# EAGLE design final (EAGLE 7.4.0)
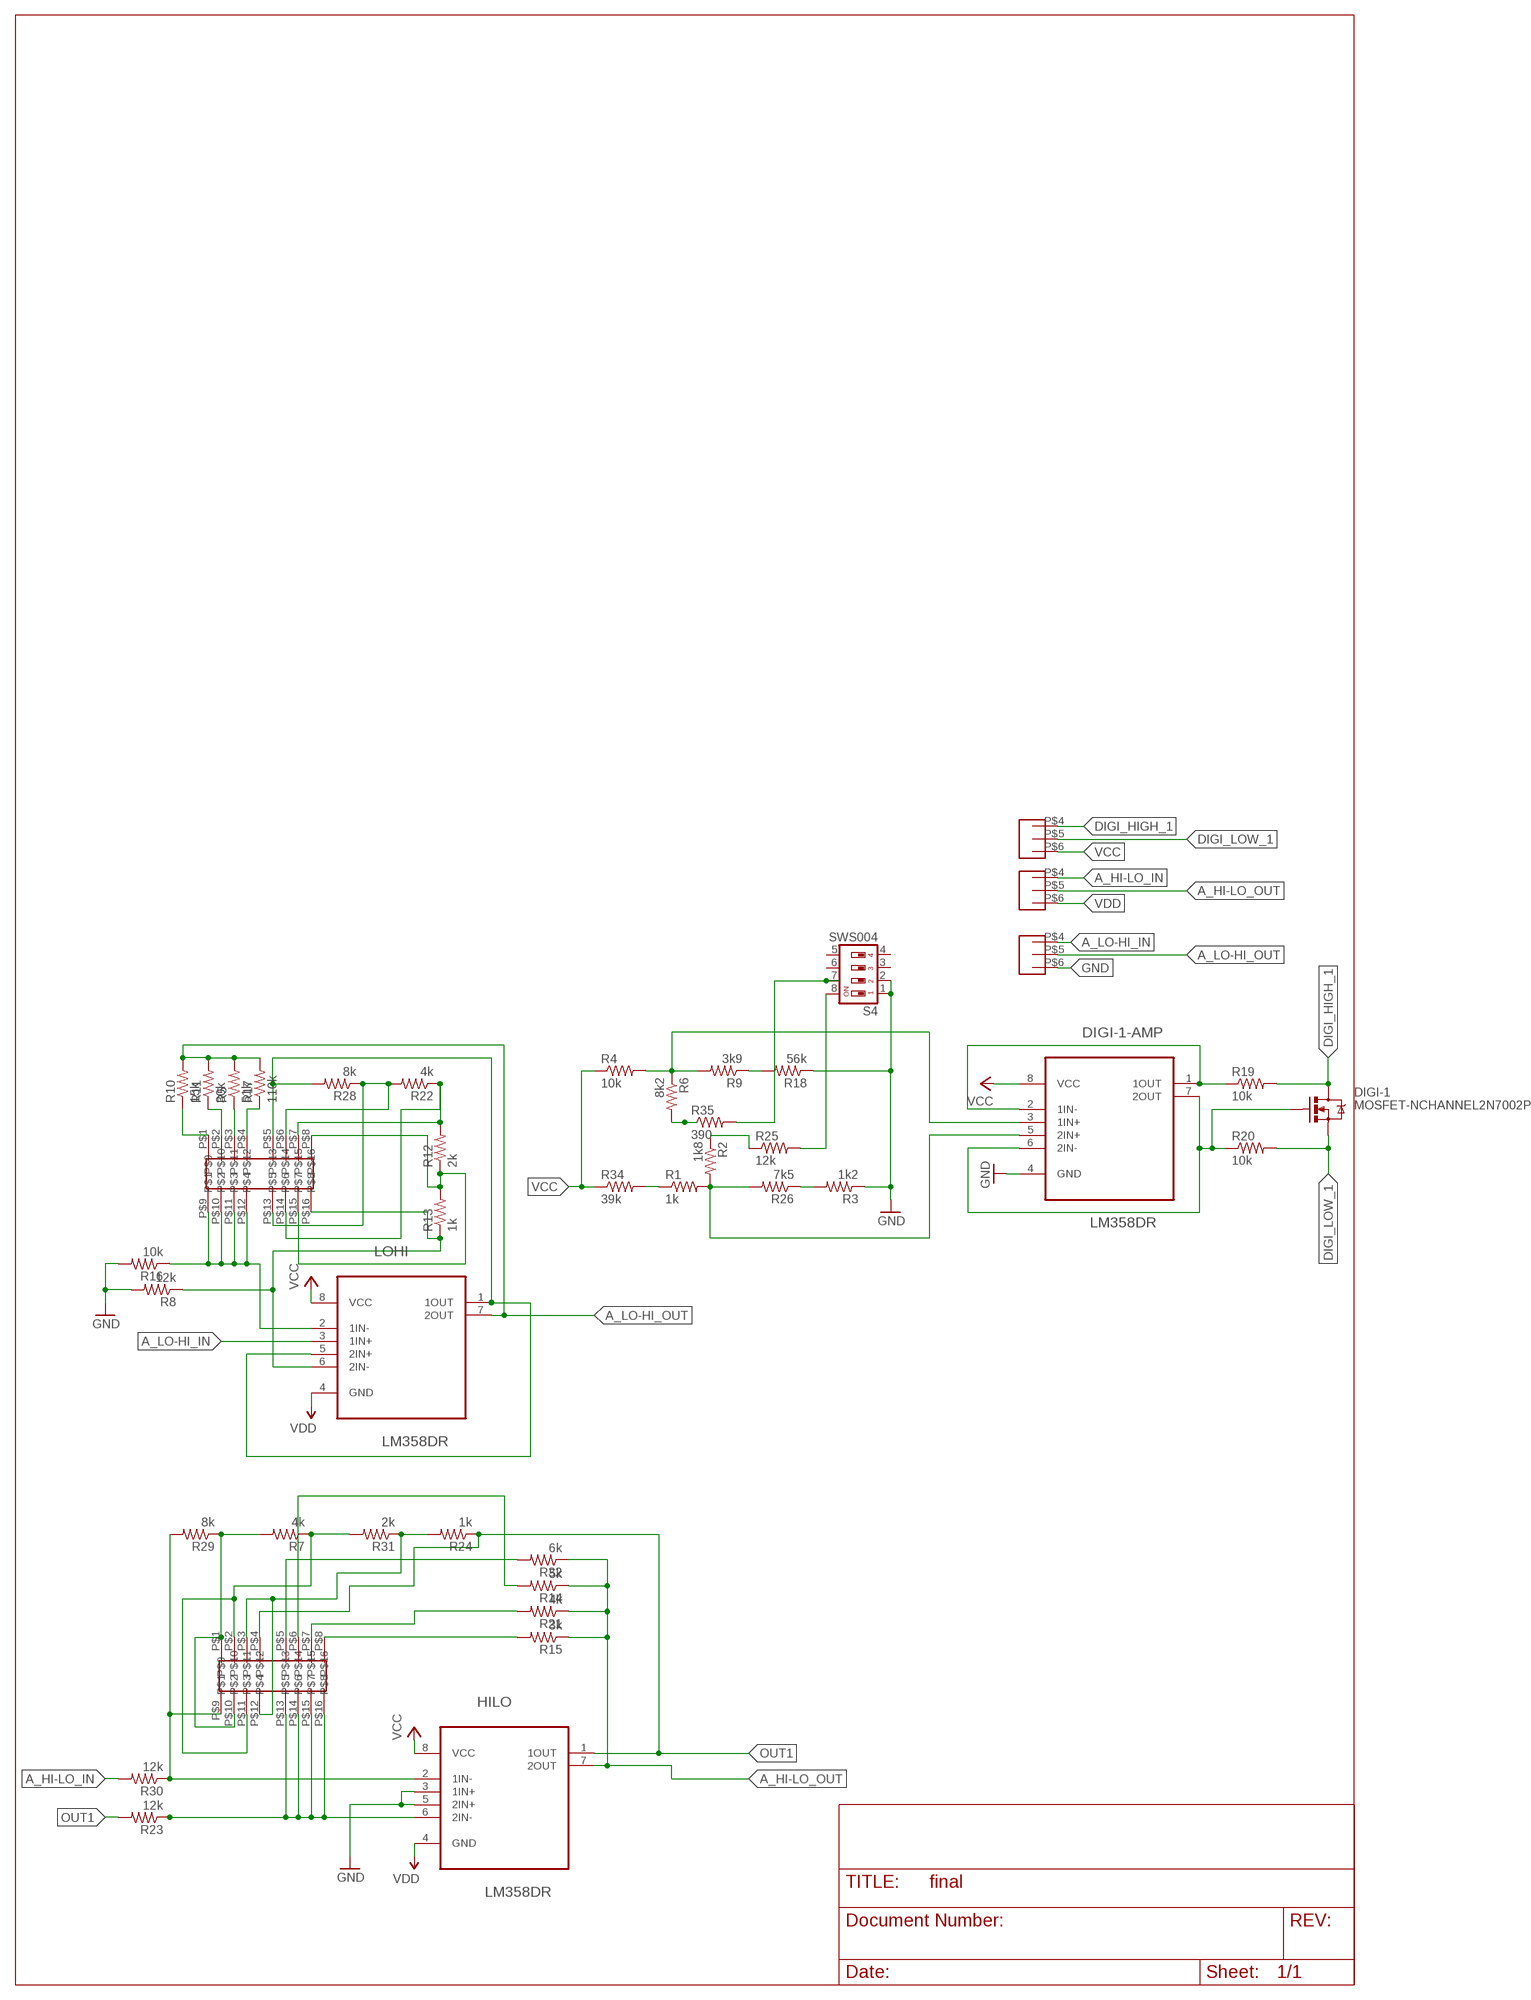
[diagram p0: schematic, sheet 1]

## Parts
DIGI-1  MOSFET-NCHANNEL2N7002PW  [SOT323]
DIGI-1-AMP  LM358DR  [SOIC127P600X175-8N]
HILO  LM358DR  [SOIC127P600X175-8N]
LOHI  LM358DR  [SOIC127P600X175-8N]
R1  1k  R-US_R0805  [R0805]
R2  1k8  R-US_R0805  [R0805]
R3  1k2  R-US_R0805  [R0805]
R4  10k  R-US_R0805  [R0805]
R5  51k  R-US_R0805  [R0805]
R6  8k2  R-US_R0805  [R0805]
R7  4k  R-US_0207/15  [0207/15]
R8  12k  R-US_R0805  [R0805]
R9  3k9  R-US_R0805  [R0805]
R10  15k  R-US_R0805  [R0805]
R11  30k  R-US_R0805  [R0805]
R12  2k  R-US_0207/15  [0207/15]
R13  1k  R-US_R0805  [R0805]
R14  5k  R-US_R0805  [R0805]
R15  3k  R-US_R0805  [R0805]
R16  10k  R-US_R0805  [R0805]
R17  110k  R-US_R0805  [R0805]
R18  56k  R-US_R0805  [R0805]
R19  10k  R-US_R0805  [R0805]
R20  10k  R-US_R0805  [R0805]
R21  4k  R-US_R0805  [R0805]
R22  4k  R-US_0207/15  [0207/15]
R23  12k  R-US_R0805  [R0805]
R24  1k  R-US_0207/15  [0207/15]
R25  12k  R-US_R0805  [R0805]
R26  7k5  R-US_R0805  [R0805]
R28  8k  R-US_0207/15  [0207/15]
R29  8k  R-US_R0805  [R0805]
R30  12k  R-US_R0805  [R0805]
R31  2k  R-US_0207/15  [0207/15]
R32  6k  R-US_R0805  [R0805]
R34  39k  R-US_R0805  [R0805]
R35  390  R-US_R0805  [R0805]
S4  SWS004  [SMS-004]
U$2  USCO_8PIN_SWITCH  [USCO_8PIN_SWITCH]
U$3  USCO_8PIN_SWITCH  [USCO_8PIN_SWITCH]
U$4  5.08PITCHTERMINAL  [10KPL508]
U$5  5.08PITCHTERMINAL  [10KPL508]
U$6  5.08PITCHTERMINAL  [10KPL508]

## Nets
A_HI-LO_IN: R30.2 U$4.P$4
A_HI-LO_OUT: HILO.7(2OUT) R14.1 R15.1 R21.1 R32.1 U$4.P$5
A_LO-HI_IN: LOHI.3(1IN+) U$6.P$4
A_LO-HI_OUT: LOHI.7(2OUT) R5.2 R10.2 R11.2 R17.2 U$6.P$5
DI-1: DIGI-1-AMP.1(1OUT) DIGI-1-AMP.2(1IN-) R19.1
DIGI_HIGH_1: DIGI-1.3(D) R19.2 U$5.P$4
DIGI_LOW_1: DIGI-1.2(S) R20.2 U$5.P$5
GND: DIGI-1-AMP.4(GND) HILO.3(1IN+) HILO.5(2IN+) R3.1 R8.2 R16.2 R18.1 S4.1 S4.2 U$6.P$6
N$2: DIGI-1-AMP.3(1IN+) R4.2 R6.1 R9.2
N$4: R25.2 S4.8
N$5: R6.2 R35.1
N$6: DIGI-1-AMP.5(2IN+) R1.2 R2.2 R26.2
N$8: DIGI-1-AMP.6(2IN-) DIGI-1-AMP.7(2OUT) DIGI-1.1(G) R20.1
N$9: R9.1 R18.2
N$10: HILO.2(1IN-) R29.2 R30.1 U$2.P$9
N$11: R2.1 R25.1
N$13: R10.1 U$3.P$1
N$14: R11.1 U$3.P$2
N$15: R1.1 R34.2
N$16: R5.1 U$3.P$3
N$17: R17.1 U$3.P$4
N$18: LOHI.1(1OUT) LOHI.5(2IN+) R28.2 U$3.P$5
N$19: R7.2 R29.1 U$2.P$1 U$2.P$10
N$20: R22.2 R28.1 U$3.P$6 U$3.P$13
N$21: R12.2 R22.1 U$3.P$7 U$3.P$14
N$22: R7.1 R31.2 U$2.P$2 U$2.P$11
N$23: R24.2 R31.1 U$2.P$3 U$2.P$12
N$24: R15.2 U$2.P$8
N$26: R21.2 U$2.P$7
N$27: R14.2 U$2.P$6
N$28: R32.2 U$2.P$5
N$29: R3.2 R26.1
N$30: HILO.6(2IN-) R23.1 U$2.P$13 U$2.P$14 U$2.P$15 U$2.P$16
N$38: R12.1 R13.2 U$3.P$8 U$3.P$15
N$42: R35.2 S4.7
N$46: LOHI.2(1IN-) R16.1 U$3.P$9 U$3.P$10 U$3.P$11 U$3.P$12
N$50: LOHI.6(2IN-) R8.1 R13.1 U$3.P$16
OUT1: HILO.1(1OUT) R23.2 R24.1 U$2.P$4
VCC: DIGI-1-AMP.8(VCC) HILO.8(VCC) LOHI.8(VCC) R4.1 R34.1 U$5.P$6
VDD: HILO.4(GND) LOHI.4(GND) U$4.P$6
Unconnected: S4.3 S4.4 S4.5 S4.6

## Library data of the parts
DIGI-1 = SparkFun-DiscreteSemi:MOSFET-NCHANNEL: Common NMOSFET Parts MFG P/N Store ID Prod ID FDD8780 TRANS-09984 SI7820DN TRANS-11055 FDS6630A IC-08089 2N7002PW TRANS-11151 FQP30N06L COM-10213 TRANS-10060 BSS123LT1G TRANS-08345 BSS138 TRANS-00830 BS170 2N7000; PROD_ID: TRANS-11151
DIGI-1-AMP HILO LOHI = Texas Instruments_By_element14_Batch_1:LM358DR: OPERATIONAL AMPLIFIERS; MPN: LM358DR; OC_FARNELL: 1831865; OC_NEWARK: 34K7599; PACKAGE: SOIC-8; SUPPLIER: Texas Instruments
R1-R26 R28-R32 R34 R35 = rcl:R-US_: RESISTOR, American symbol
S4 = smd-special:SWS004: SMD Dip Switch 4 pol.
U$2 U$3 = USCO_8PIN_SWITCH:USCO_8PIN_SWITCH
U$4-U$6 = ruuviliitin_3pin:5.08PITCHTERMINAL

## Board
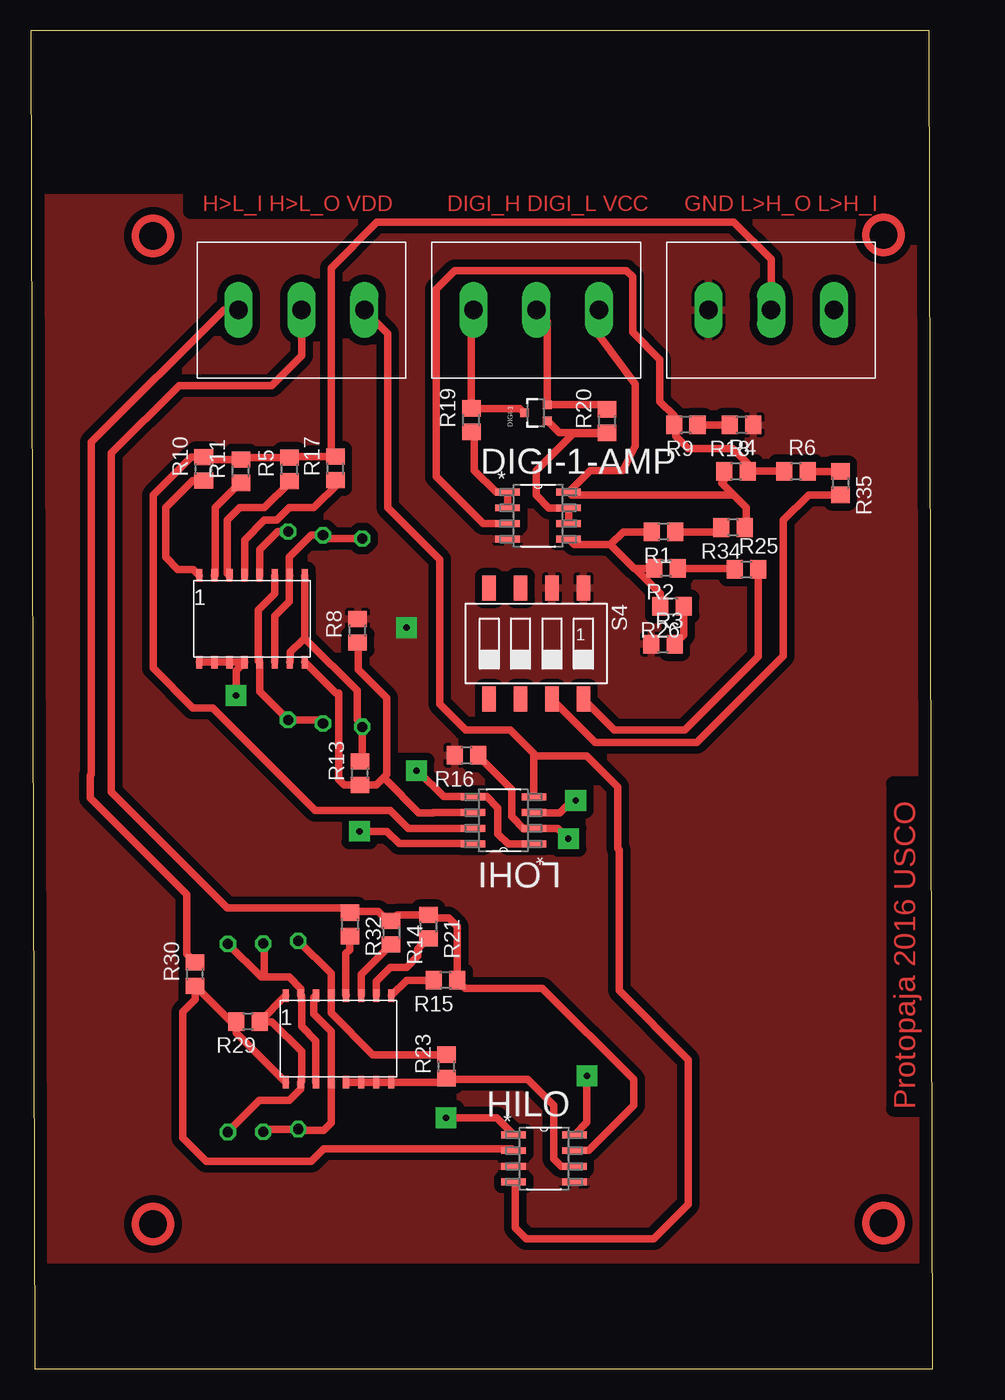
[diagram p1: board, top side]
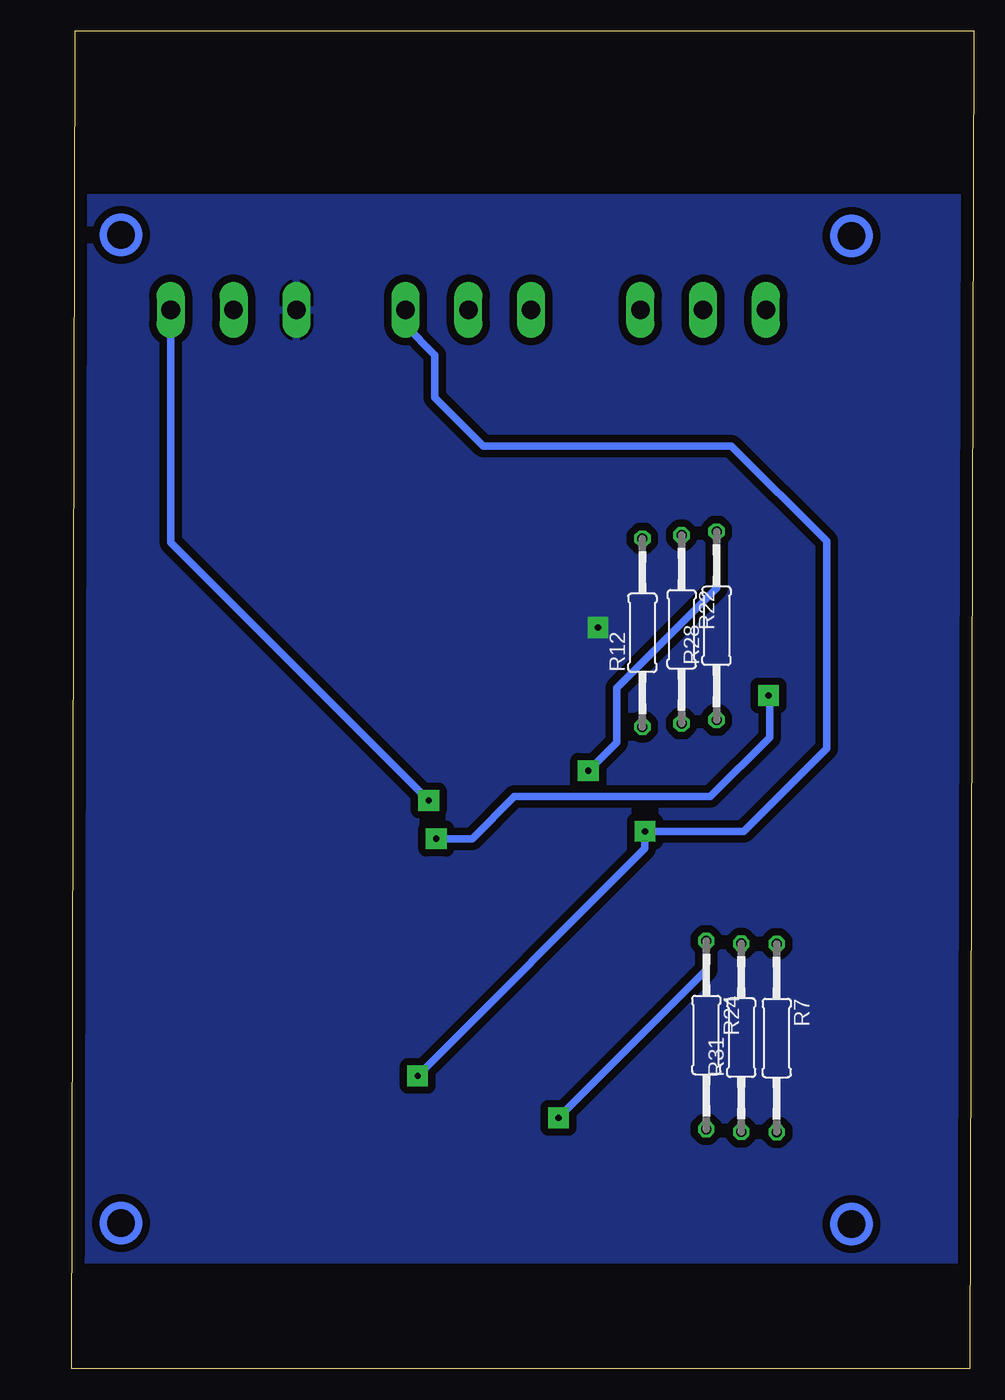
[diagram p2: board, bottom side, seen from below]

Size 73 x 108.3 mm. Coordinates in mm from the lower left corner, seen from the top.
Outline: 0.3,0 73,0 72.7,108.3 0,108.3 0.3,0
Copper layers (1*16): Top 0.035mm / dielectric 1.5mm / Bottom 0.035mm
Design rules "default": minimum track width 10mil, minimum drill 24mil, track to track 8mil, track to pad 8mil, pad to pad 8mil, via to via 8mil, smd to smd 8mil, copper to edge 40mil, drill to drill 8mil, minimum pad ring 10mil, minimum via ring 8mil, stop-mask expansion 4mil, vias tented up to drill 0mil, thermal gap 10mil

### Footprints (pad centres in the part's own frame; a part is rotated, then mirrored left to right if it is on the bottom)
SOT323 = smd 0.7 x 0.7: 1 -0.65,-0.925; 2 0.65,-0.925; 3 0,0.925
SOIC127P600X175-8N = smd 1.981 x 0.559: 1 -2.464,1.905; 2 -2.464,0.635; 3 -2.464,-0.635; 4 -2.464,-1.905; 5 2.464,-1.905; 6 2.464,-0.635; 7 2.464,0.635; 8 2.464,1.905
R0805 = smd 1.3 x 1.5: 1 -0.95,0; 2 0.95,0
0207/15 = drill 0.813 octagon: 1 -7.62,0; 2 7.62,0
SMS-004 = smd 1.092 x 2.007: 1 -3.81,-4.496; 2 -1.27,-4.496; 3 1.27,-4.496; 4 3.81,-4.496; 5 3.81,4.496; 6 1.27,4.496; 7 -1.27,4.496; 8 -3.81,4.496
USCO_8PIN_SWITCH = smd 0.508 x 1.016: P$1 -4.27,3.51; P$2 -3.05,3.51; P$3 -1.83,3.51; P$4 -0.61,3.51; P$5 0.61,3.51; P$6 1.83,3.51; P$7 3.05,3.51; P$8 4.27,3.51; P$9 -4.27,-3.51; P$10 -3.05,-3.51; P$11 -1.83,-3.51; P$12 -0.61,-3.51; P$13 0.61,-3.51; P$14 1.83,-3.51; P$15 3.05,-3.51; P$16 4.27,-3.51
10KPL508 = drill 1.5 long: P$4 -5.08,0; P$5 0,0; P$6 5.08,0

### Placement (x,y rotation side)
DIGI-1  40.86,77.38 90 top
DIGI-1-AMP  41.05,69.05 0 top
HILO  41.53,17.02 0 top
LOHI  38.24,44.38 180 top
R1  51.21,67.74 180 top
R2  51.41,64.79 180 top
R3  51.15,58.66 0 top
R4  57.07,72.66 0 top
R5  20.94,72.79 90 top
R6  61.91,72.66 0 top
R7  15.94,26.77 270 bottom
R8  26.44,59.75 90 top
R9  53,76.4 180 top
R10  13.99,72.84 90 top
R11  16.99,72.66 90 top
R12  26.81,59.58 90 bottom
R13  26.64,48.19 90 top
R14  29.16,35.29 270 top
R15  33.57,31.44 180 top
R16  35.25,49.64 180 top
R17  24.64,72.87 90 top
R18  57.51,76.39 180 top
R19  35.64,76.79 90 top
R20  46.64,76.71 90 top
R21  32.16,35.77 270 top
R22  23.64,59.85 270 bottom
R23  33.64,24.47 90 top
R24  21.64,27.01 270 bottom
R25  57.9,64.7 0 top
R26  51.9,61.7 180 top
R28  20.81,60.14 90 bottom
R29  17.57,28.09 180 top
R30  13.29,31.95 90 top
R31  18.81,26.79 90 bottom
R32  25.81,35.96 270 top
R34  56.81,68.09 180 top
R35  65.51,71.69 270 top
S4  40.9,58.7 180 top
U$2  24.9,26.7 0 top
U$3  17.9,60.7 0 top
U$4  21.9,85.7 0 top
U$5  40.9,85.7 0 top
U$6  59.9,85.7 180 top

### Tracks (layer width: path | path; a pad name or v marks a point on that pad's centre or on a via)
A_HI-LO_IN
  Top 0.61: R30.2 12.6,33.59 12.6,38.4 4.8,46.2 4.8,48 4.9,48.1 4.9,75 15.6,85.7 U$4.P$4
A_HI-LO_OUT
  Top 0.61: HILO.7 45.16,17.66 48.8,21.3 48.8,23.4 41.4,30.8 35.16,30.8 R15.1 34.52,35.78 33.8,36.5 32.38,36.5 R21.1 29.64,36.72 R14.1 28.86,36.24 28.1,37 25.9,37 R32.1 25.42,37.3 15.9,37.3 6.5,46.7 6.5,74.1 12,79.6 19.5,79.6 21.9,82 U$4.P$5
A_LO-HI_IN  (via drill 0.5 pad 1.68)
  Top 0.61: LOHI.3 40.72,45 42.8,45 43.8,46 v44.1,46
  Bottom 0.61: v44.1,46 64.98,66.88 U$6.P$4
A_LO-HI_OUT
  Top 0.61: 35.73,43.7 LOHI.7 30.55,43.74 29.1,45.2 23,45.2 14.7,53.5 13.1,53.5 9.9,56.7 9.9,70.7 12.99,73.79 R10.2 14.17,73.61 R11.2 17.12,73.74 R5.2 21.02,73.82 R17.2 24.2,74.26 24.3,74.36 24.3,89.1 28,92.8 56.9,92.8 59.9,89.8 59.9,89.3 59.9,88.8 U$6.P$5
DI-1
  Top 0.61: R19.1 35.9,75.58 35.9,72.7 37.65,70.95 DIGI-1-AMP.1 DIGI-1-AMP.2
DIGI_HIGH_1
  Top 0.61: U$5.P$4 35.64,85.7 R19.2 39.58,77.74 DIGI-1.3
DIGI_LOW_1
  Top 0.61: 46.9,77.7 R20.2 46.27,78.03 DIGI-1.2 41.78,84.81 U$5.P$5
GND  (via drill 0.5 pad 1.68)
  Top 0.61: S4.1 44.71,63.51 44.9,63.7
  other vias: 30.4,60
  pour Bottom (isolate 0.61): 1,94.8 1,8.8 72,8.8 72,94.8
  pour Top (isolate 0.61): 1,94.8 1,8.8 72,8.8 72,94.8
N$2
  Top 0.61: R4.2 R6.1 | 57.85,72.83 R4.2 | R4.2 58.02,73.28 56.8,74.5 53.2,74.5 52.2,75.5 52.2,76.25 R9.2 52.05,77.15 50.9,78.3 50.9,81.7 48.7,83.9 48.7,88.4 48.2,88.9 34.3,88.9 32.8,87.4 32.8,72.2 36.6,68.4 38.57,68.4 DIGI-1-AMP.3
N$4
  Top 0.61: S4.8 47.21,51.7 52.9,51.7 58.85,57.65 R25.2
N$5
  Top 0.61: R6.2 62.88,72.64 R35.1
N$6
  Top 0.61: R2.2 48.9,64.79 | 48.9,64.79 48.81,64.79 46.9,66.7 | 46.9,66.7 43.96,66.7 DIGI-1-AMP.5 | R1.2 47.94,67.74 46.9,66.7 | R26.2 50.95,62.74 48.9,64.79
N$8
  Top 0.61: DIGI-1.1 42.76,75.76 R20.1 46.58,75.7 43.9,75.7 40.9,72.7 40.9,70.7 41.91,69.69 DIGI-1-AMP.7 DIGI-1-AMP.6
N$9
  Top 0.61: R9.1 R18.2
N$10
  Top 0.61: U$2.P$9 16.62,27.2 R29.2 16.2,28.09 R30.1 13.29,29.89 12.3,28.9 12.3,18.7 14.2,16.8 22.7,16.8 23.7,17.8 38.92,17.8 HILO.2
N$11
  Top 0.61: R2.1 56.86,64.79 R25.1
N$13
  Top 0.61: U$3.P$1 13.14,64.7 11.9,64.7 10.9,65.7 10.9,69.7 13.09,71.89 R10.1
N$14
  Top 0.61: R11.1 16.91,71.71 14.9,69.7 14.9,64.26 U$3.P$2
N$15
  Top 0.61: R1.1 55.51,67.74 R34.2
N$16
  Top 0.61: R5.1 20.94,71.74 18.9,69.7 16.9,69.7 15.9,68.7 15.9,64.38 U$3.P$3
N$17
  Top 0.61: R17.1 24.68,71.92 24.9,71.7 22.9,69.7 20.9,69.7 19.9,68.7 18.9,68.7 17.29,67.09 U$3.P$4
N$18  (via drill 0.5 pad 1.68)
  Top 0.61: R28.2 19.96,67.76 18.51,66.31 U$3.P$5 | LOHI.1 38.62,42.47 37.8,43.3 37.8,45.4 36.9,46.3 35.79,46.3 LOHI.5 35.76,46.3 33.4,46.3 31.3,48.4 v31.2,48.4
  Bottom 0.61: v31.2,48.4 28.9,50.7 28.9,55.1 20.81,63.19 R28.2
N$19
  Top 0.61: U$2.P$1 R29.1 19.51,28.09 21.9,25.7 21.9,23.24 U$2.P$10 21.85,22.65 20.9,21.7 18.49,21.7 R7.2
N$20
  Top 0.61: R22.2 23.35,52.52 R28.1 18.51,54.82 U$3.P$13 18.4,57.3 18.4,61.4 19.73,62.73 U$3.P$6
N$21
  Top 0.61: R12.2 23.91,67.2 R22.1 22.67,67.47 20.9,65.7 20.9,64.26 U$3.P$7 20.9,64.16 20.9,62.1 19.73,60.93 U$3.P$14
N$22
  Top 0.61: R7.1 18.63,31.7 18.9,31.7 | 18.9,31.7 20.9,31.7 21.85,30.75 U$2.P$2 21.9,30.16 21.9,27.7 23.07,26.53 U$2.P$11 | R31.2 18.9,34.32 18.9,31.7
N$23
  Top 0.61: 24.29,23.09 U$2.P$12 | R24.2 21.4,19.63 | U$2.P$12 24.29,27.31 22.9,28.7 22.9,30.04 U$2.P$3 | R31.1 19.03,19.39 R24.2 | R24.2 21.73,19.3 23.7,19.3 24.29,19.89 U$2.P$12
N$24
  Top 0.61: U$2.P$8 30.4,31.44 R15.2
N$26
  Top 0.61: R21.2 31.3,33.96 31.3,33.4 30.4,32.5 29.1,32.5 27.95,31.35 U$2.P$7
N$27
  Top 0.61: R14.2 26.73,31.91 U$2.P$6
N$28
  Top 0.61: U$2.P$5 25.5,33.6 25.81,33.91 R32.2
N$29
  Top 0.61: R26.1 52.85,59.41 R3.2
N$30
  Top 0.61: U$2.P$13 U$2.P$14 U$2.P$15 U$2.P$16 33.31,23.19 R23.1 33.76,23.4 40.2,23.4 42.3,21.3 42.3,17 42.91,16.39 HILO.6
N$38
  Top 0.61: R13.2 26.81,49.31 R12.1 26.9,52.05 26.4,52.55 26.4,54.9 22.3,59 | U$3.P$15 21,57.24 21,58 22,59 22.3,59 | 22.3,59 22.17,59.13 U$3.P$8
N$42
  Top 0.61: S4.7 45.67,50.7 53.9,50.7 60.9,57.7 60.9,68.7 62.94,70.74 R35.2
N$46  (via drill 0.5 pad 1.68)
  Top 0.61: U$3.P$9 U$3.P$10 U$3.P$11 U$3.P$12 16.6,56.5 v16.6,54.5 | 40.75,43.7 LOHI.2 42.66,43.74 v43.5,42.9 | 40.75,43.7 40.9,43.7 | 40.75,43.7 39.9,43.7 38.9,44.7 38.9,46.9 36.2,49.6 R16.1
  Bottom 0.61: v16.6,54.5 16.5,54.4 16.5,51.1 21.3,46.3 37.2,46.3 40.6,42.9 v43.5,42.9
N$50
  Top 0.61: U$3.P$16 24.66,54.7 24.9,54.7 24.9,47.7 25.36,47.24 R13.1 27.94,47.24 28.4,47.7 | LOHI.6 32.59,45.02 32.57,45 31.4,45 28.7,47.7 28.4,47.7 | R8.1 26.5,58.74 26.5,56.6 28.8,54.3 28.8,48.1 28.4,47.7
OUT1  (via drill 0.5 pad 1.68)
  Top 0.61: R24.1 24.29,31.98 U$2.P$4 24.3,28.8 27.68,25.42 R23.2 33.36,25.7 | HILO.1 37.69,20.3 v33.6,20.3
  Bottom 0.61: v33.6,20.3 21.64,32.26 R24.1
VCC  (via drill 0.5 pad 1.68)
  Top 0.61: U$5.P$6 45.98,83.62 48.9,79.7 48.9,74.7 47.9,72.7 45.26,72.7 DIGI-1-AMP.8 43.77,70.7 56.9,70.7 | R34.1 57.9,68.23 57.9,69.7 56.9,70.7 | 56.9,70.7 55.9,71.7 56.12,71.92 R4.1 | HILO.8 45,19.93 v45,23.7 | LOHI.8 35.75,42.5 29.8,42.5 28.8,43.5 v26.6,43.5
  Bottom 0.61: v45,23.7 26.6,42.1 v26.6,43.5 18.6,43.5 11.9,50.2 11.9,67 19.6,74.7 39.7,74.7 43.6,78.6 43.6,82.04 45.98,84.42 U$5.P$6
VDD
  Top 0.61: HILO.4 39.2,14.98 39.2,11.4 40.1,10.5 50.4,10.5 53.2,13.3 53.2,25 47.6,30.6 47.6,42 47.5,42.1 47.5,47.1 45,49.6 40.7,49.6 | U$4.P$6 28.9,83.78 28.9,69.7 33.1,65.5 33.1,53.8 35.2,51.7 38.8,51.7 40.7,49.8 40.7,49.6 | 40.7,49.6 LOHI.4
(copper drawn outside any net)
  shapes: Bottom circle x4, Top circle x4

### Text on the board
Top: H>L_I H>L_O VDD DIGI_H DIGI_L VCC GND L>H_O L>H_I | Protopaja 2016 USCO